# EAGLE design board-Type-C-31-M-12 (EAGLE 9.6.2)
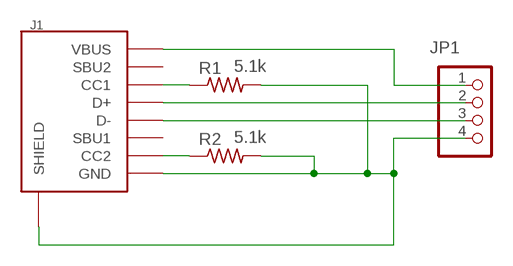
[diagram p0: schematic, sheet 1]

## Parts
J1  USB-TYPE-C-31-M-12  [USB-TYPE-C-31-M-12]
JP1  PINHD-1X4  [1X04]
R1  5.1k  RR0603  [R0603]
R2  5.1k  RR0603  [R0603]

## Nets
GND [power]: J1.GND1(GND) J1.GND2(GND) J1.SHLD-B1(SHIELD) J1.SHLD-B2(SHIELD) J1.SHLD-B3(SHIELD) J1.SHLD-B4(SHIELD) J1.SHLD-T1(SHIELD) J1.SHLD-T2(SHIELD) J1.SHLD-T3(SHIELD) J1.SHLD-T4(SHIELD) JP1.4 R1.2 R2.2
N$2: J1.A6(D+) J1.B6(D+) JP1.2
N$3: J1.A7(D-) J1.B7(D-) JP1.3
N$5: J1.A5(CC1) R1.1
N$6: J1.B5(CC2) R2.1
VBUS [power]: J1.VBUS1(VBUS) J1.VBUS2(VBUS) JP1.1
Unconnected: J1.A8(SBU1) J1.B8(SBU2)

## Library data of the parts
J1 = angrypig7-Connectors-USB:USB-TYPE-C-31-M-12
JP1 = angrypig7-Connectors-PinHeads:PINHD-1X4: PIN HEADER
R1 R2 = angrypig7-RCL:R; SPICEPREFIX: R

## Net classes
0 default: width 0.254 mm
1 power: width 0.406 mm

## Board
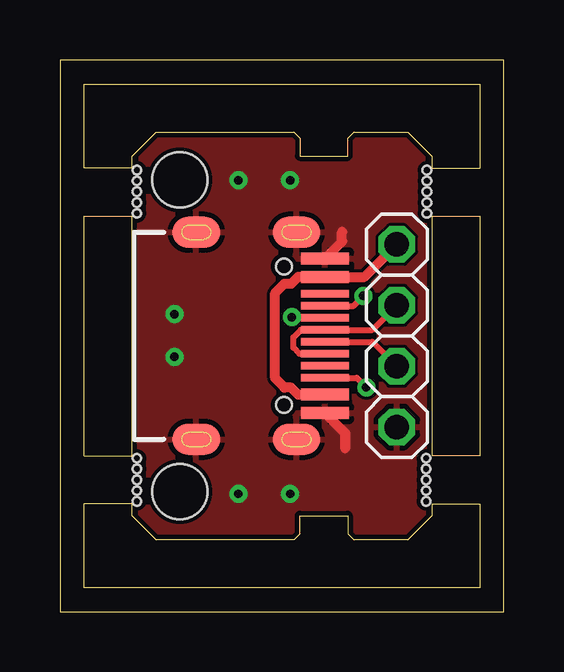
[diagram p1: board, top side]
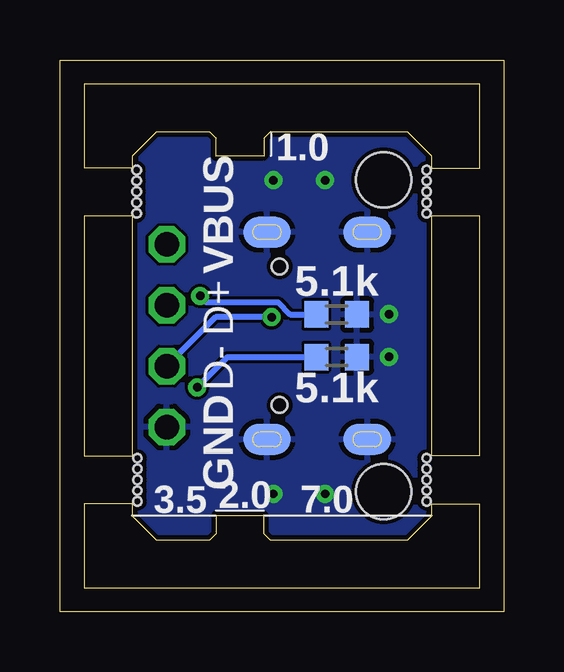
[diagram p2: board, bottom side, seen from below]

Size 18.5 x 23 mm. Coordinates in mm from the lower left corner, seen from the top.
Outline: 3,4 3,4.5 1,4.5 1,1 17.5,1 17.5,4.5 15.5,4.5 15.5,4 14.5,3 12.25,3 12,3.25 12,4 10,4 10,3.25 9.75,3 4,3 3,4
Outline: 3,6.5 3,16.5 1,16.5 1,6.5 3,6.5
Outline: 3,18.5 3,19 4,20 9.75,20 10,19.75 10,19 12,19 12,19.75 12.25,20 14.5,20 15.5,19 15.5,18.5 17.5,18.5 17.5,22 1,22 1,18.5 3,18.5
Outline: 15.5,16.5 15.5,6.5 17.5,6.5 17.5,16.5 15.5,16.5
Outline: 0,0 18.5,0 18.5,23 0,23 0,0
Copper layers (1*16): Top 0.035mm / dielectric 1.5mm / Bottom 0.035mm
Design rules "JLCPCB_2-Layer": minimum track width 5mil, minimum drill 0.2mm, track to track 5mil, track to pad 5mil, pad to pad 5mil, via to via 5mil, smd to smd 5mil, copper to edge 8mil, drill to drill 3mil, minimum pad ring 3mil, minimum via ring 0.2mm, stop-mask expansion 4mil, vias tented up to drill 15mil, thermal gap 8mil
Holes 2.3 mm at 5,18 5,5
Holes 0.35 mm at 3.21,18.41 3.21,17.96 3.21,17.51 3.21,17.06 3.21,16.61 15.3,18.41 15.3,17.96 15.3,17.51 15.3,17.06 15.3,16.61 15.27,6.39 15.27,5.94 15.27,5.49 15.27,5.04 15.27,4.59 3.21,6.39 3.21,5.94 3.21,5.49 3.21,5.04 3.21,4.59

### Footprints (pad centres in the part's own frame; a part is rotated, then mirrored left to right if it is on the bottom)
USB-TYPE-C-31-M-12 = smd 0.3 x 2: A5 -1.25,1.19; A6 -0.25,1.19; A7 0.25,1.19; A8 1.25,1.19; B5 1.75,1.19; B6 0.75,1.19; B7 -0.75,1.19; B8 -1.75,1.19 | smd 0.5 x 2: GND1 -3.225,1.19; GND2 3.225,1.19; VBUS1 -2.45,1.19; VBUS2 2.45,1.19 | smd 1.3 x 2 bottom: SHLD-B1 -4.32,0; SHLD-B2 4.32,0; SHLD-B3 -4.32,-4.18; SHLD-B4 4.32,-4.18 | smd 1.3 x 2: SHLD-T1 -4.32,0; SHLD-T2 4.32,0; SHLD-T3 -4.32,-4.18; SHLD-T4 4.32,-4.18 | hole 0.65: -2.89,-0.53; 2.89,-0.53
1X04 = drill 1.016 octagon: 1 -3.81,0; 2 -1.27,0; 3 1.27,0; 4 3.81,0
R0603 = smd 1 x 1.1: 1 -0.85,0; 2 0.85,0

### Placement (x,y rotation side)
J1  9.87,11.5 270 top
JP1  14.05,11.5 270 top
R1  6.96,12.39 0 bottom
R2  6.96,10.61 0 bottom

### Tracks (layer width: path | path; a pad name or v marks a point on that pad's centre or on a via)
GND  (via drill 0.35)
  Top 0.406: J1.GND2 11.89,7.44 11.89,6.81 | J1.GND1 11.76,15.43 11.76,15.83
  other vias: 4.78,10.62 4.78,12.4 9.6,17.99 7.45,17.99 9.6,4.91 7.45,4.91
  pour Bottom: 15.25,3.13 3.25,3.13 3.25,19.87 15.25,19.87
  pour Top: 15.25,3.13 3.25,3.13 3.25,19.87 15.25,19.87
N$2
  Top 0.254: J1.B6 9.98,10.75 9.73,11 9.73,11.43 10.05,11.75 J1.A6 13.03,11.75 JP1.2
N$3  (via drill 0.35)
  Top 0.254: JP1.3 13.03,11.25 J1.A7 | J1.B7 9.7,12.25 v9.67,12.27
  Bottom 0.254: v9.67,12.27 12.01,12.27 JP1.3
N$5  (via drill 0.35)
  Top 0.254: J1.A5 12.24,12.75 v12.65,13.16
  Bottom 0.254: R1.1 8.9,12.39 9.41,12.9 12.39,12.9 v12.65,13.16
N$6  (via drill 0.35)
  Top 0.254: J1.B5 12.38,9.75 v12.78,9.35
  Bottom 0.254: v12.78,9.35 11.52,10.61 R2.1
VBUS
  Top 0.406: J1.VBUS2 9.93,9.05 9.64,9.34 9.36,9.34 8.97,9.73 8.97,13.28 9.35,13.66 9.64,13.66 9.93,13.95 J1.VBUS1 12.69,13.95 JP1.1

### Text on the board
bPlace: 1.0 | VBUS | D+ | D- | GND | 7.0 | 2.0 | 3.5